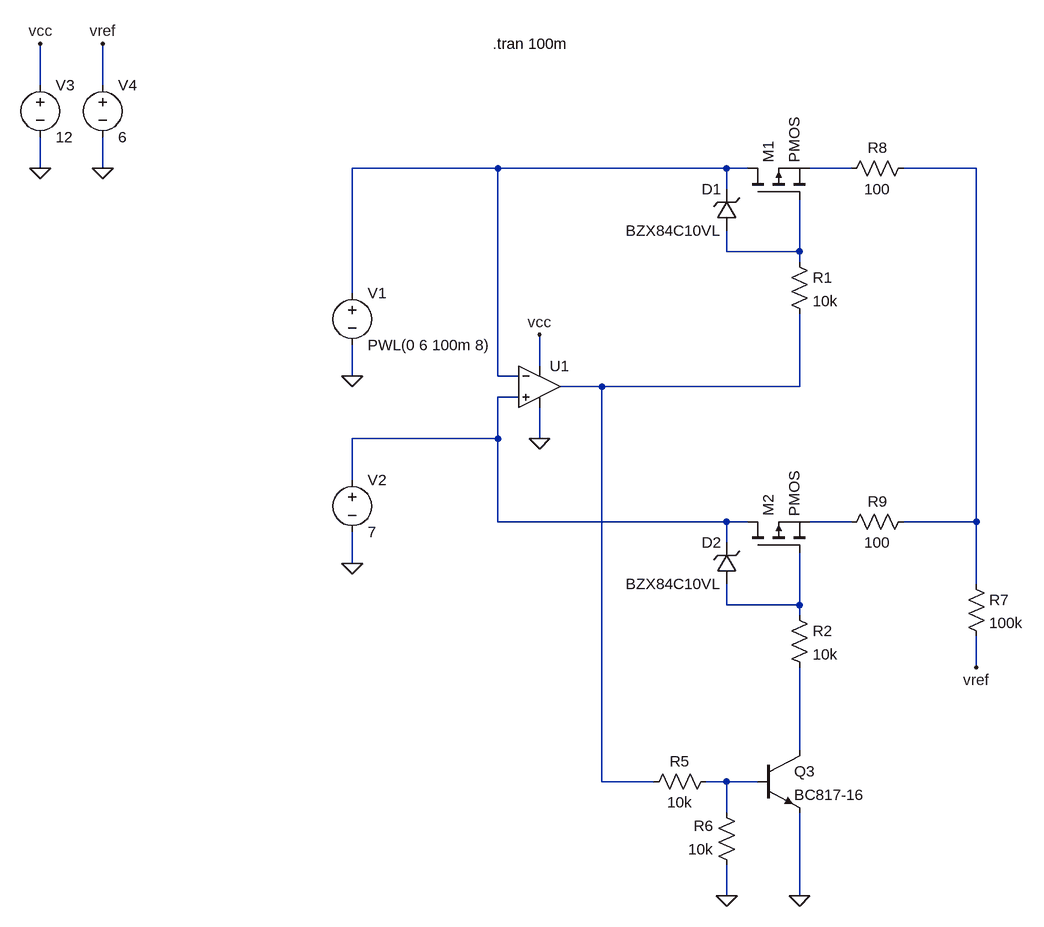
[diagram p0: schematic max_02.asc]
max_02.asc, the LTspice schematic file:
Version 4
SHEET 1 1056 1076
WIRE -864 -192 -864 -256
WIRE -768 -192 -768 -256
WIRE -864 -64 -864 -112
WIRE -768 -64 -768 -112
WIRE -160 -64 -384 -64
WIRE 192 -64 -160 -64
WIRE 224 -64 192 -64
WIRE 384 -64 320 -64
WIRE 576 -64 464 -64
WIRE 192 -32 192 -64
WIRE 192 64 192 32
WIRE 304 64 304 -16
WIRE 304 64 192 64
WIRE 304 80 304 64
WIRE -384 128 -384 -64
WIRE -96 240 -96 192
WIRE -384 256 -384 208
WIRE -160 256 -160 -64
WIRE -128 256 -160 256
WIRE 0 272 -64 272
WIRE 304 272 304 160
WIRE 304 272 0 272
WIRE -128 288 -160 288
WIRE -160 352 -160 288
WIRE -160 352 -384 352
WIRE -96 352 -96 304
WIRE -384 416 -384 352
WIRE -160 480 -160 352
WIRE 192 480 -160 480
WIRE 224 480 192 480
WIRE 384 480 320 480
WIRE 576 480 576 -64
WIRE 576 480 464 480
WIRE 192 512 192 480
WIRE -384 544 -384 496
WIRE 576 576 576 480
WIRE 192 608 192 576
WIRE 304 608 304 528
WIRE 304 608 192 608
WIRE 304 624 304 608
WIRE 576 704 576 656
WIRE 304 832 304 704
WIRE 0 880 0 272
WIRE 80 880 0 880
WIRE 192 880 160 880
WIRE 240 880 192 880
WIRE 192 928 192 880
WIRE 192 1056 192 1008
WIRE 304 1056 304 928
FLAG -384 544 0
FLAG -384 256 0
FLAG -864 -64 0
FLAG -864 -256 vcc
FLAG -96 352 0
FLAG -96 192 vcc
FLAG 304 1056 0
FLAG 192 1056 0
FLAG -768 -64 0
FLAG -768 -256 vref
FLAG 576 704 vref
SYMBOL voltage -384 112 R0
WINDOW 123 0 0 Left 2
WINDOW 39 0 0 Left 2
SYMATTR InstName V1
SYMATTR Value PWL(0 6 100m 8)
SYMBOL voltage -384 400 R0
WINDOW 123 0 0 Left 2
WINDOW 39 0 0 Left 2
SYMATTR InstName V2
SYMATTR Value 7
SYMBOL Opamps\\UniversalOpamp2 -96 272 R0
SYMATTR InstName U1
SYMBOL voltage -864 -208 R0
SYMATTR InstName V3
SYMATTR Value 12
SYMBOL npn 240 832 R0
SYMATTR InstName Q3
SYMATTR Value BC817-16
SYMBOL res 176 864 R90
WINDOW 0 0 56 VBottom 2
WINDOW 3 32 56 VTop 2
SYMATTR InstName R5
SYMATTR Value 10k
SYMBOL res 208 1024 R180
WINDOW 0 36 76 Left 2
WINDOW 3 36 40 Left 2
SYMATTR InstName R6
SYMATTR Value 10k
SYMBOL res 560 560 R0
SYMATTR InstName R7
SYMATTR Value 100k
SYMBOL res 480 -80 R90
WINDOW 0 0 56 VBottom 2
WINDOW 3 32 56 VTop 2
SYMATTR InstName R8
SYMATTR Value 100
SYMBOL res 480 464 R90
WINDOW 0 0 56 VBottom 2
WINDOW 3 32 56 VTop 2
SYMATTR InstName R9
SYMATTR Value 100
SYMBOL voltage -768 -208 R0
SYMATTR InstName V4
SYMATTR Value 6
SYMBOL pmos 224 -16 R270
SYMATTR InstName M1
SYMBOL res 288 64 R0
SYMATTR InstName R1
SYMATTR Value 10k
SYMBOL zener 208 32 R180
WINDOW 0 24 64 Left 2
WINDOW 3 24 0 Left 2
SYMATTR InstName D1
SYMATTR Value BZX84C10VL
SYMATTR Description Diode
SYMATTR Type diode
SYMBOL pmos 224 528 R270
SYMATTR InstName M2
SYMBOL res 288 608 R0
SYMATTR InstName R2
SYMATTR Value 10k
SYMBOL zener 208 576 R180
WINDOW 0 24 64 Left 2
WINDOW 3 24 0 Left 2
SYMATTR InstName D2
SYMATTR Value BZX84C10VL
SYMATTR Description Diode
SYMATTR Type diode
TEXT -168 -256 Left 2 !.tran 100m

The netlist it stands for:
* max_02.asc
V1 N001 0 PWL(0 6 100m 8)
V2 N006 0 7
XU1 N006 N001 vcc 0 N005 level.2 Avol=1Meg GBW=10Meg Slew=10Meg ilimit=25m rail=0 Vos=0 phimargin=45 en=0 enk=0 in=0 ink=0 Rin=500Meg  ; pins IN+ IN- V+ V- OUT
V3 vcc 0 12
Q3 N009 N010 0 0 BC817-16
R5 N010 N005 10k
R6 0 N010 10k
R7 N003 vref 100k
R8 N003 N002 100
R9 N003 N007 100
V4 vref 0 6
M1 N001 N004 N002 N002 PMOS
R1 N004 N005 10k
D1 N004 N001 BZX84C10VL
M2 N006 N008 N007 N007 PMOS
R2 N008 N009 10k
D2 N008 N006 BZX84C10VL
.model D D
.lib standard.dio
.model NPN NPN
.model PNP PNP
.lib standard.bjt
.model NMOS NMOS
.model PMOS PMOS
.lib standard.mos
.tran 100m
.lib UniversalOpamps2.sub
.backanno
.end